# Altium schematic sheet Top Level.SchDoc
size A4; SheetNumber: 1; SheetTotal: 2
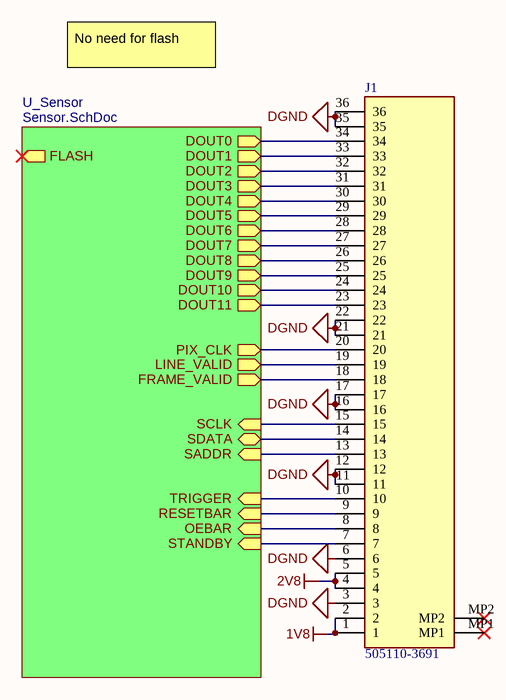
[diagram p0: Top Level.SchDoc]

## Parts
J1  505110-3691  [5051103691]

## Sub-sheets
U_Sensor = Sensor.SchDoc: DOUT6 (out), DOUT7 (out), DOUT8 (out), DOUT9 (out), DOUT10 (out), DOUT11 (out), DOUT0 (out), DOUT1 (out), DOUT2 (out), DOUT3 (out), DOUT4 (out), DOUT5 (out), SCLK (in), SDATA (bidir), LINE_VALID (out), FRAME_VALID (out), PIX_CLK (out), SADDR (in), TRIGGER (in), OEBAR (in), RESETBAR (in), FLASH (out), STANDBY (in)

## Nets
1V8: J1.1 J1.2
2V8: J1.4 J1.5
DGND: J1.3 J1.6 J1.11 J1.12 J1.16 J1.17 J1.21 J1.22 J1.35 J1.36
NetJ1_7: J1.7 ; sheet U_Sensor/STANDBY
NetJ1_8: J1.8 ; sheet U_Sensor/OEBAR
NetJ1_9: J1.9 ; sheet U_Sensor/RESETBAR
NetJ1_10: J1.10 ; sheet U_Sensor/TRIGGER
NetJ1_13: J1.13 ; sheet U_Sensor/SADDR
NetJ1_14: J1.14 ; sheet U_Sensor/SDATA
NetJ1_15: J1.15 ; sheet U_Sensor/SCLK
NetJ1_18: J1.18 ; sheet U_Sensor/FRAME_VALID
NetJ1_19: J1.19 ; sheet U_Sensor/LINE_VALID
NetJ1_20: J1.20 ; sheet U_Sensor/PIX_CLK
NetJ1_23: J1.23 ; sheet U_Sensor/DOUT11
NetJ1_24: J1.24 ; sheet U_Sensor/DOUT10
NetJ1_25: J1.25 ; sheet U_Sensor/DOUT9
NetJ1_26: J1.26 ; sheet U_Sensor/DOUT8
NetJ1_27: J1.27 ; sheet U_Sensor/DOUT7
NetJ1_28: J1.28 ; sheet U_Sensor/DOUT6
NetJ1_29: J1.29 ; sheet U_Sensor/DOUT5
NetJ1_30: J1.30 ; sheet U_Sensor/DOUT4
NetJ1_31: J1.31 ; sheet U_Sensor/DOUT3
NetJ1_32: J1.32 ; sheet U_Sensor/DOUT2
NetJ1_33: J1.33 ; sheet U_Sensor/DOUT1
NetJ1_34: J1.34 ; sheet U_Sensor/DOUT0

Not connected (* = marked no-connect by the designer): J1 MP1* MP2*

## Notes on the sheet
- No need for flash

## Library data of the parts
J1 = 505110-3691: Connector; Manufacturer_Name: Molex; Datasheet Link: https://www.molex.com/content/dam/molex/molex-dot-com/products/automated/en-us/salesdrawingpdf/505/505110/5051103691_sd.pdf; Height: 2.1mm; Manufacturer_Part_Number: 505110-3691; Mouser Part Number: N/A; Mouser Price/Stock: https://www.mouser.com/Search/Refine.aspx?Keyword=N%2FA